# EAGLE design ScubaSteve_PWR (EAGLE 9.2.2)
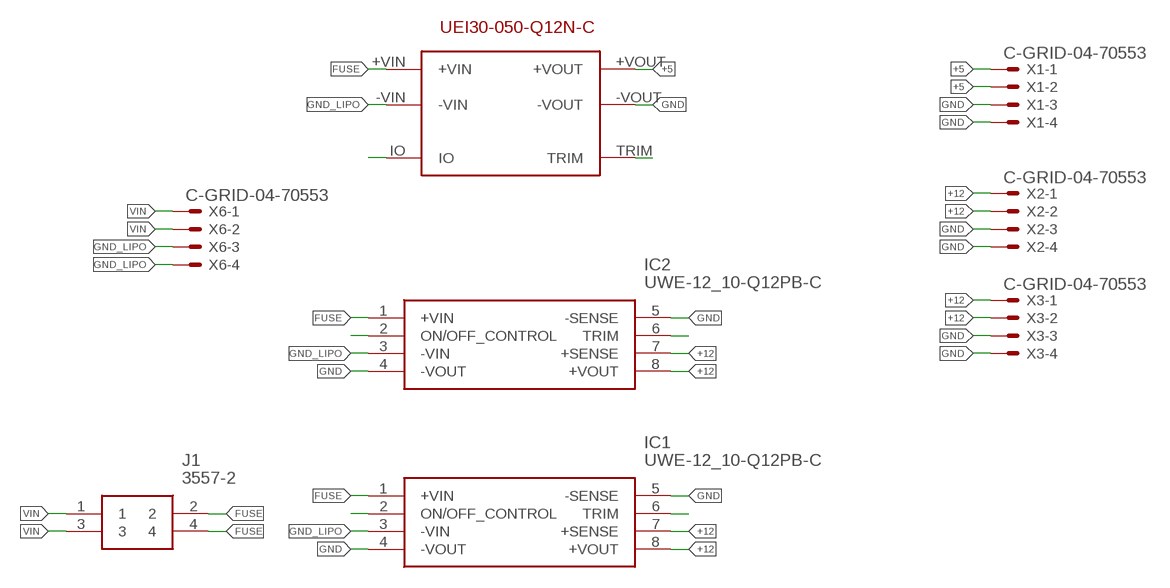
[diagram p0: schematic, sheet 1]

## Parts
IC1  UWE-12_10-Q12PB-C  [UWE520Q48NC]
IC2  UWE-12_10-Q12PB-C  [UWE520Q48NC]
J1  3557-2  [3557-2]
U$1  UEI30-050-Q12N-C  [UEI30-050-Q12N-C]
X1  C-GRID-04-70553  [70553-04]
X2  C-GRID-04-70553  [70553-04]
X3  C-GRID-04-70553  [70553-04]
X6  C-GRID-04-70553  [70553-04]

## Nets
+5: U$1.+VOUT X1.1 X1.2
+12: IC1.7(+SENSE) IC1.8(+VOUT) IC2.7(+SENSE) IC2.8(+VOUT) X2.1 X2.2 X3.1 X3.2
FUSE: IC1.1(+VIN) IC2.1(+VIN) J1.2 J1.4 U$1.+VIN
GND: IC1.4(-VOUT) IC1.5(-SENSE) IC2.4(-VOUT) IC2.5(-SENSE) U$1.-VOUT X1.3 X1.4 X2.3 X2.4 X3.3 X3.4
GND_LIPO: IC1.3(-VIN) IC2.3(-VIN) U$1.-VIN X6.3 X6.4
N$3: U$1.IO
N$4: U$1.TRIM
N$8: IC2.2(ON/OFF_CONTROL)
N$12: IC2.6(TRIM)
N$16: IC1.2(ON/OFF_CONTROL)
N$20: IC1.6(TRIM)
VIN: J1.1 J1.3 X6.1 X6.2

## Library data of the parts
IC1 IC2 = SamacSys_Parts:UWE-12_10-Q12PB-C: Isolated DC/DC Converters 120W 9-36Vin 12Vout Positive Logic w/BP Source: Datasheet <https://componentsearchengine.com/Datasheets/1/UWE-12_10-Q12PB-C.pdf>; DESCRIPTION: Isolated DC/DC Converters 120W 9-36Vin 12Vout Positive Logic w/BP; HEIGHT: 9mm; MANUFACTURER_NAME: Murata Electronics; MANUFACTURER_PART_NUMBER: UWE-12/10-Q12PB-C; MOUSER_PART_NUMBER: 580-UWE-12/10Q12PBC; MOUSER_PRICE-STOCK: https://www.mouser.com/Search/Refine.aspx?Keyword=580-UWE-12%2F10Q12PBC
J1 = SamacSys_Parts:3557-2: THM 2 in 1 Auto Blade Holder P/N 3557-2 Source: Datasheet <https://componentsearchengine.com/Datasheets/1/3557-2.pdf>; DESCRIPTION: THM 2 in 1 Auto Blade Holder P/N 3557-2; HEIGHT: mm; MANUFACTURER_NAME: Keystone Electronics; MANUFACTURER_PART_NUMBER: 3557-2; MOUSER_PART_NUMBER: 534-3557-2
U$1 = UEI30-050-Q12N-C:UEI30-050-Q12N-C
X1-X3 X6 = con-molex:C-GRID-04: CONNECTOR wire to board 2.54 mm (0.100") pitch header; MF: MOLEX; OC_FARNELL: unknown; OC_NEWARK: unknown

## Board
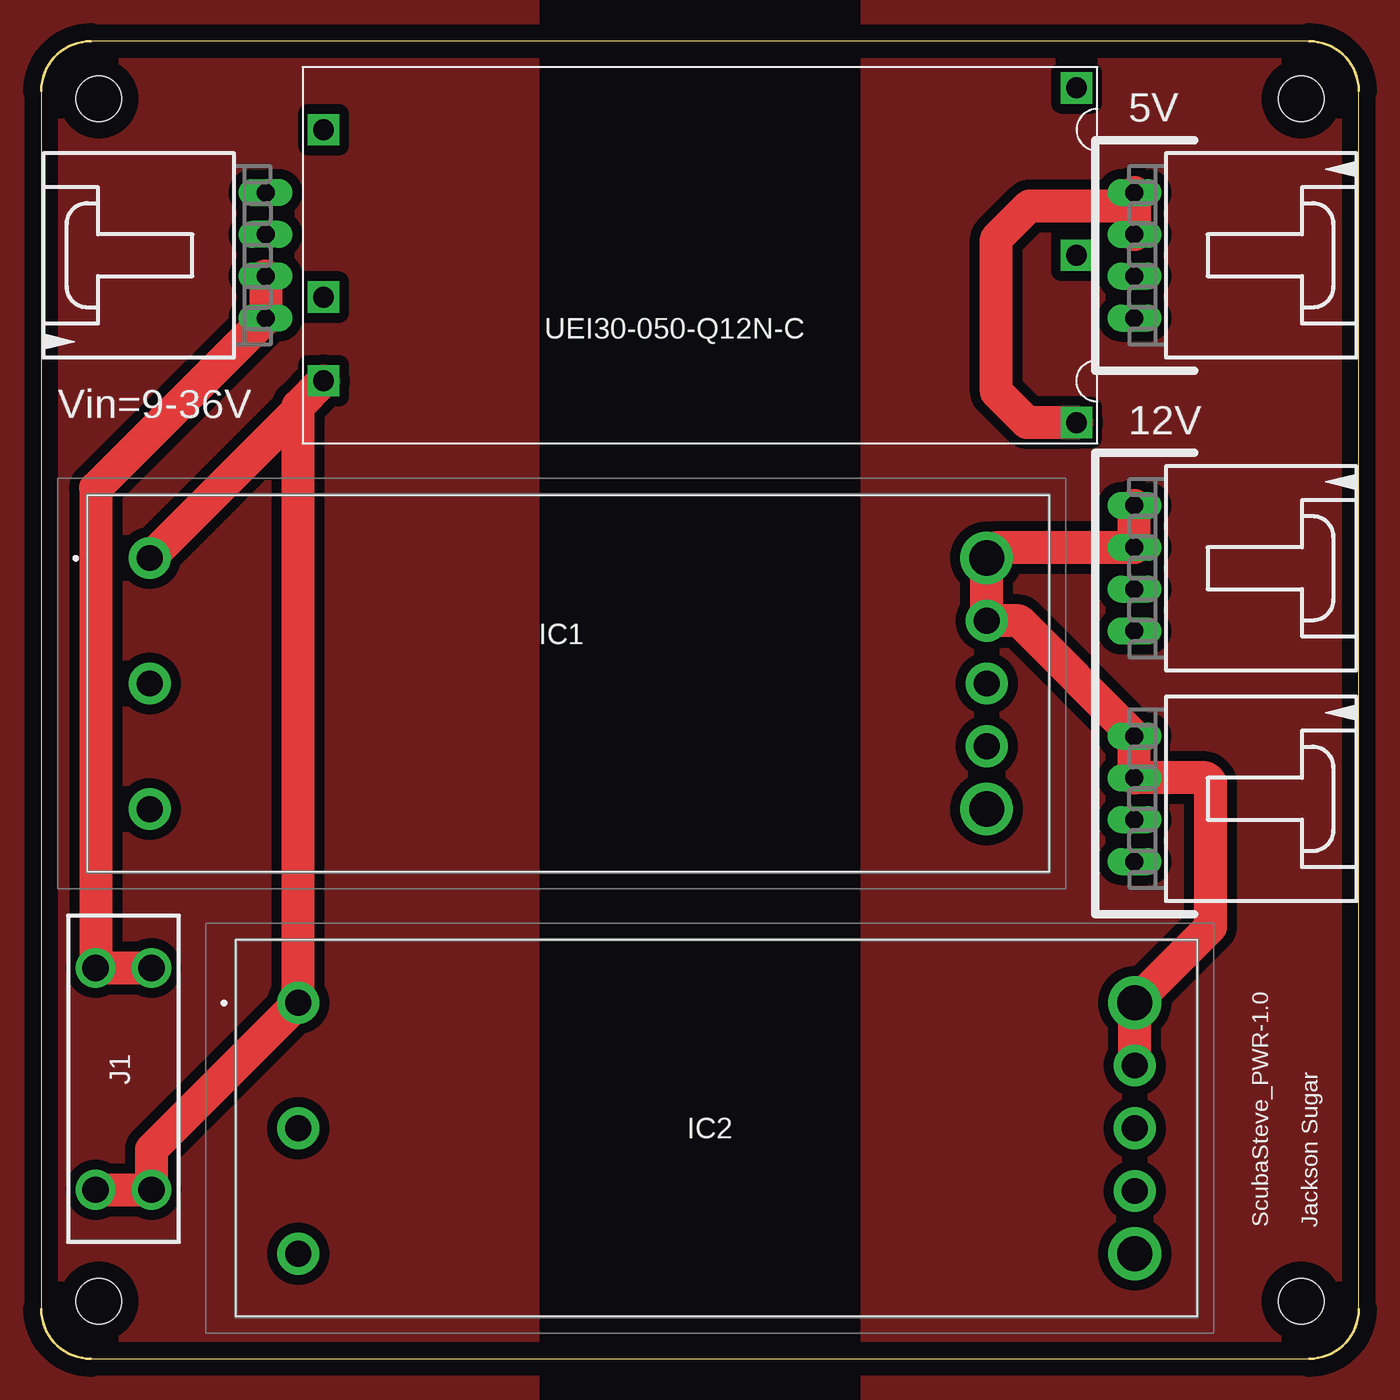
[diagram p1: board, top side]
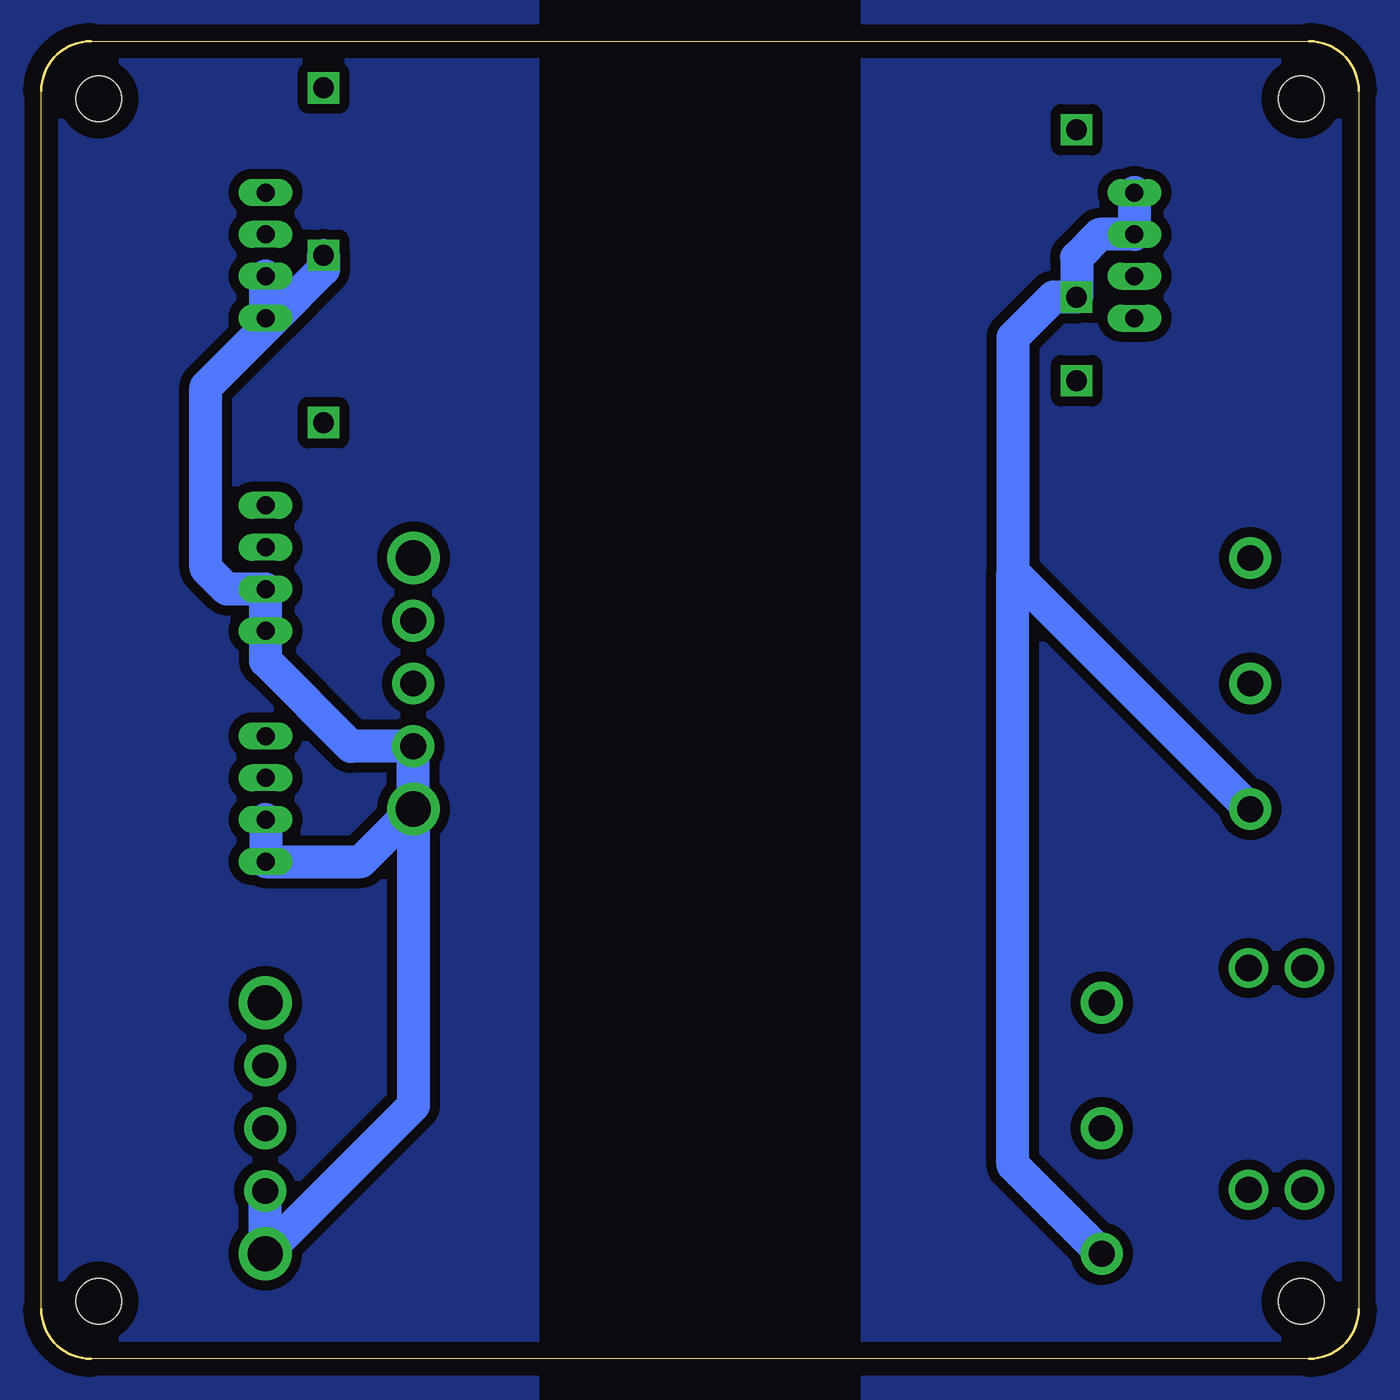
[diagram p2: board, bottom side, seen from below]

Size 80 x 80 mm. Coordinates in mm from the lower left corner, seen from the top.
Outline: 3,0 77,0 arc90 80,3 80,77 arc90 77,80 3,80 arc90 0,77 0,3 arc90 3,0
Copper layers (1*16): Top 0.035mm / dielectric 1.5mm / Bottom 0.035mm
Design rules "default": minimum track width 6mil, minimum drill 0.35mm, track to track 6mil, track to pad 6mil, pad to pad 6mil, via to via 6mil, smd to smd 6mil, copper to edge 40mil, drill to drill 6mil, minimum pad ring 10mil, minimum via ring 8mil, stop-mask expansion 4mil, vias tented up to drill 0mil, thermal gap 10mil
Holes 2.75 mm at 3.5,76.5 3.5,3.5 76.5,3.5 76.5,76.5

### Footprints (pad centres in the part's own frame; a part is rotated, then mirrored left to right if it is on the bottom)
UWE520Q48NC = drill 1.575 pad 2.54: 1 -25.4,7.62; 2 -25.4,0; 3 -25.4,-7.62; 5 25.4,-3.81; 6 25.4,0; 7 25.4,3.81 | drill 2.134 pad 3.2: 4 25.4,-7.62; 8 25.4,7.62
3557-2 = drill 1.6 pad 2.4: 1 -6.735,1.7; 2 6.735,1.7; 3 -6.735,-1.7; 4 6.735,-1.7
UEI30-050-Q12N-C = drill 1.27 square: +VIN 22.86,7.62; +VOUT -22.86,10.16; -VIN 22.86,2.54; -VOUT -22.86,0; IO 22.86,-7.62; TRIM -22.86,-10.16
70553-04 = drill 1.092 long: 1 -3.81,-7.62; 2 -1.27,-7.62; 3 1.27,-7.62; 4 3.81,-7.62

### Placement (x,y rotation side)
IC1  32,41 0 top
IC2  41,14 0 top
J1  5,17 270 top
U$1  40,67 180 top
X1  74,67 270 top
X2  74,48 270 top
X3  74,34 270 top
X6  6,67 90 top

### Tracks (layer width: path | path; a pad name or v marks a point on that pad's centre or on a via)
+5
  Top 2: U$1.+VOUT 59.86,56.84 58,58.7 58,68 60,70 65.57,70 X1.1 X1.2
+12
  Top 2: IC2.7 IC2.8 71,26.22 71,35 70.73,35.27 X3.2 X3.1 59.38,44.81 IC1.7 IC1.8 58.05,49.27 X2.2 X2.1
B1
  pour Bottom (isolate 0.61): -20,90 30,90 30,-10 -15,-10 -20,-10
B2
  pour Bottom (isolate 0.61): 50,90 50,-10 100,-10 100,90
FUSE
  Top 2: J1.4 J1.2 6.7,12.72 IC2.1 15.6,57.62 | U$1.+VIN 15.6,57.84 15.6,57.62 | IC1.1 15.6,57.62
GND
  Bottom 2: IC2.5 IC2.4 57.4,15.38 IC1.4 | IC1.4 IC1.5 61.19,37.19 66.38,42.38 X2.4 X2.3 68.73,46.73 70,48 70,59 65.81,63.19 | X3.3 X3.4 60.59,30.19 IC1.4 | 65.81,63.19 X1.4 X1.3 | U$1.-VOUT 62.86,66.14 65.81,63.19
GND_LIPO
  Bottom 2: 21,47.78 21,62 18.54,64.46 U$1.-VIN 17.14,66.86 15.73,68.27 X6.3 X6.4 | 21,47.78 IC1.3 | IC2.3 21,11.78 21,47.78
T1
  pour Top (isolate 0.61): 30,90 -15,90 -15,-10 30,-10
T2
  pour Top (isolate 0.61): 50,90 95,90 95,-10 50,-10
VIN
  Top 2: X6.2 X6.1 3.3,52.87 J1.3 J1.1

### Text on the board
tPlace: ScubaSteve_PWR-1.0 | Jackson Sugar
tNames: 5V | Vin=9-36V | 12V